# Altium schematic sheet EVK-IRIS-W1-RMII.SchDoc
size A3; DocumentNumber: 12; SheetNumber: 12; SheetTotal: 14
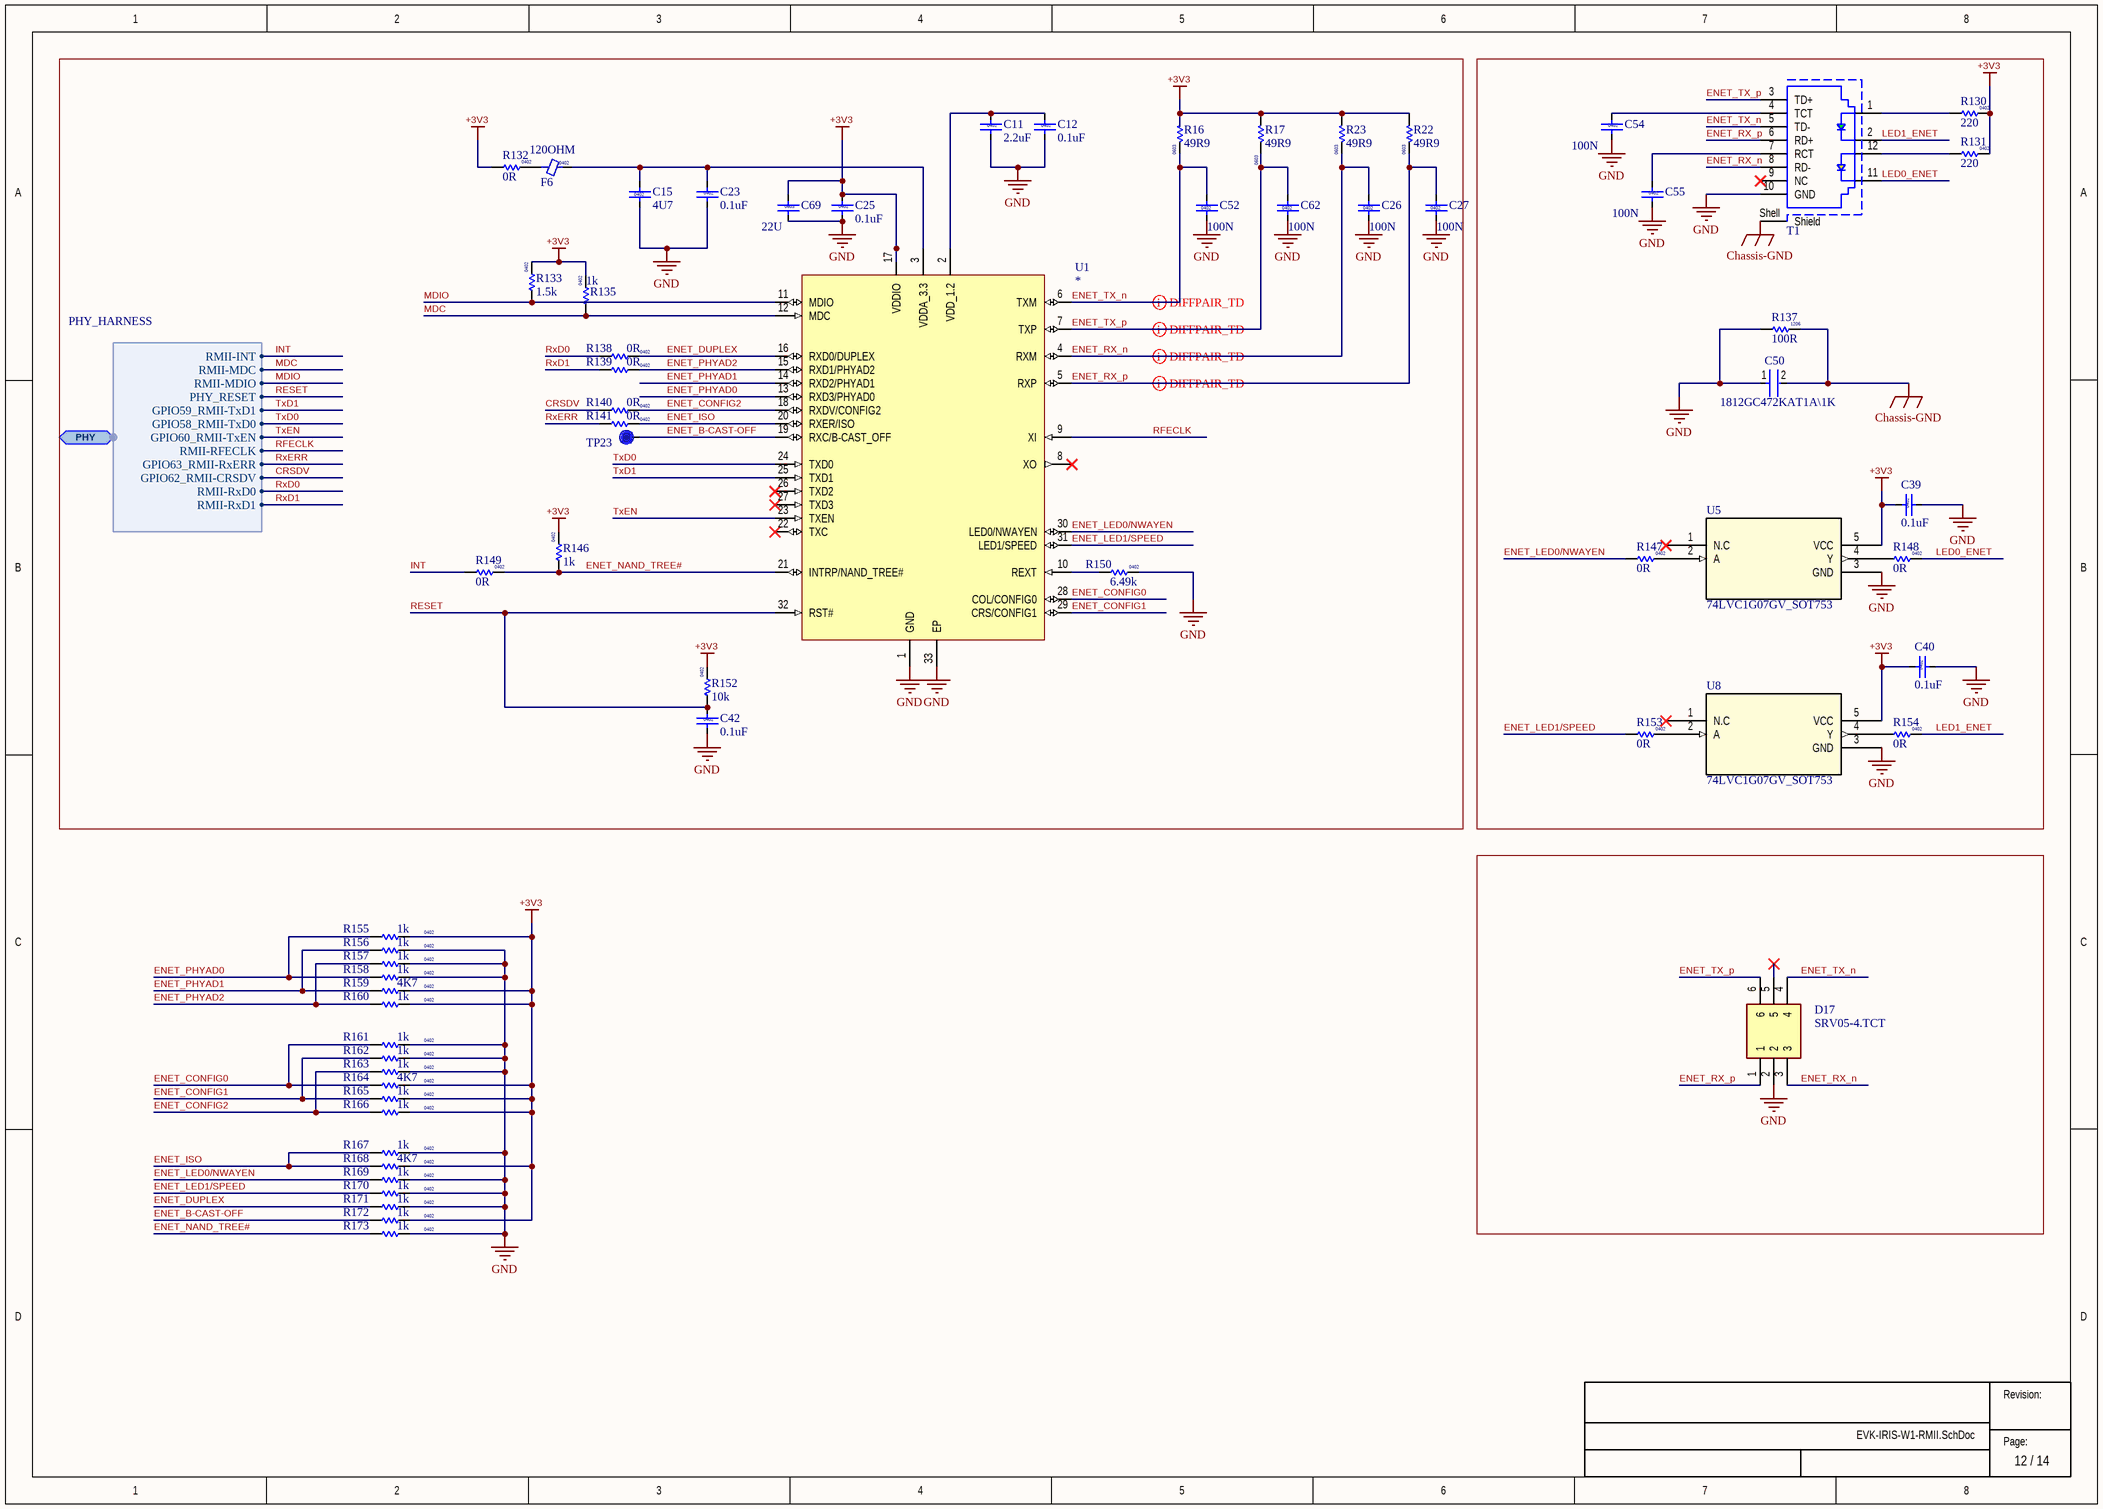
[diagram p0: EVK-IRIS-W1-RMII.SchDoc]

## Parts
C11  value 2.2uF  Size: 0402  [Cap 0402 HD]
C12  value 0.1uF  Size: 0402  [Cap 0402 HD]
C15  value 4U7  Size: 0402  [Cap_0402_1200Lx700Wx700H_600x600Pad_350G_FLX]
C23  value 0.1uF  Size: 0402  [Cap 0402 HD]
C25  value 0.1uF  Size: 0402  [Cap 0402 HD]
C26  value 100N  Size: 0402  [Cap 0402 HD]
C27  value 100N  Size: 0402  [Cap 0402 HD]
C39  value 0.1uF  Size: 0402  [Cap 0402 HD]
C40  value 0.1uF  Size: 0402  [Cap 0402 HD]
C42  value 0.1uF  Size: 0402  [Cap 0402 HD]
C50  1812GC472KAT1A\1K  [FP-1812-L_4_6_0_5-W_3_2_0-MFG]
C52  value 100N  Size: 0402  [CAP 0402]
C54  value 100N  Size: 0402  [Cap 0402]
C55  value 100N  Size: 0402  [Cap 0402]
C62  value 100N  Size: 0402  [CAP 0402]
C69  value 22U  Size: 0603  [cap 0603]
D17  SRV05-4.TCT  [SOT95P280X145-6N]
F6  value 120OHM  Size: 0402  [IND 0402]
R16  value 49R9  Size: 0603  [RES 0603 HD]
R17  value 49R9  Size: 0603  [RES 0603 HD]
R22  value 49R9  Size: 0603  [RES 0603 HD]
R23  value 49R9  Size: 0603  [RES 0603 HD]
R130  value 220  Size: 0402  [RES 0402 HD]
R131  value 220  Size: 0402  [RES 0402 HD]
R132  value 0R  Size: 0402  [RES 0402 HD]
R133  value 1.5k  Size: 0402  [RES 0402 HD]
R135  value 1k  Size: 0402  [RES 0402 HD]
R137  value 100R  Size: 1206  [RES 1206]
R138  value 0R  Size: 0402  [RES 0402 HD]
R139  value 0R  Size: 0402  [RES 0402 HD]
R140  value 0R  Size: 0402  [RES 0402 HD]
R141  value 0R  Size: 0402  [RES 0402 HD]
R146  value 1k  Size: 0402  [RES 0402 HD]
R147  value 0R  Size: 0402  [RES 0402 HD]
R148  value 0R  Size: 0402  [RES 0402 HD]
R149  value 0R  Size: 0402  [RES 0402 HD]
R150  value 6.49k  Size: 0402  [RES 0402 HD]
R152  value 10k  Size: 0402  [RES 0402 HD]
R153  value 0R  Size: 0402  [RES 0402 HD]
R154  value 0R  Size: 0402  [RES 0402 HD]
R155  value 1k  Size: 0402  [RES 0402 HD]
R156  value 1k  Size: 0402  [RES 0402 HD]
R157  value 1k  Size: 0402  [RES 0402 HD]
R158  value 1k  Size: 0402  [RES 0402 HD]
R159  value 4K7  Size: 0402  [RES 0402 HD]
R160  value 1k  Size: 0402  [RES 0402 HD]
R161  value 1k  Size: 0402  [RES 0402 HD]
R162  value 1k  Size: 0402  [RES 0402 HD]
R163  value 1k  Size: 0402  [RES 0402 HD]
R164  value 4K7  Size: 0402  [RES 0402 HD]
R165  value 1k  Size: 0402  [RES 0402 HD]
R166  value 1k  Size: 0402  [RES 0402 HD]
R167  value 1k  Size: 0402  [RES 0402 HD]
R168  value 4K7  Size: 0402  [RES 0402 HD]
R169  value 1k  Size: 0402  [RES 0402 HD]
R170  value 1k  Size: 0402  [RES 0402 HD]
R171  value 1k  Size: 0402  [RES 0402 HD]
R172  value 1k  Size: 0402  [RES 0402 HD]
R173  value 1k  Size: 0402  [RES 0402 HD]
T1  74980111211  [74980111211]  (value not drawn)
TP23  TP  [TP10R]  (value not drawn)
U1  (no value)  [QFN0.5P8x8-32Pin_W-Pad]
U5  74LVC1G07GV_SOT753  [sot-753]
U8  74LVC1G07GV_SOT753  [sot-753]

## Ports
PHY (bidir, harness PHY_HARNESS)

## Harnesses
PHY_HARNESS: RMII-MDIO, RMII-MDC, PHY_RESET, RMII-INT, GPIO59_RMII-TxD1, GPIO58_RMII-TxD0, GPIO60_RMII-TxEN, RMII-RFECLK, GPIO63_RMII-RxERR, GPIO62_RMII-CRSDV, RMII-RxD0, RMII-RxD1

## Nets
+3V3: C25.1 C39.1 C40.1 C69.1 R16.1 R17.1 R22.1 R23.1 R130.2 R131.2 R132.1 R133.2 R135.2 R146.2 R152.2 R155.2 R159.2 R160.2 R164.2 R165.2 R166.2 R168.2 R172.2 U1.17(VDDIO) U5.5(VCC) U8.5(VCC)
Chassis-GND: C50.2 R137.2 T1.Shell(Shield)
GND: C11.2 C12.2 C15.2 C23.2 C25.2 C26.1 C27.1 C39.2 C40.2 C42.2 C50.1 C52.2 C54.2 C55.2 C62.1 C69.2 D17.2 R137.1 R150.2 R156.2 R157.2 R158.2 R161.2 R162.2 R163.2 R167.2 R169.2 R170.2 R171.2 R173.2 T1.10(GND) U1.1(GND) U1.33(EP) U5.3(GND) U8.3(GND)
CRSDV: R140.1 ; port PHY.GPIO62_RMII-CRSDV
ENET_B-CAST-OFF: R172.1 TP23.1 U1.19(RXC/B-CAST_OFF)
ENET_CONFIG0: R161.1 R164.1 U1.28(COL/CONFIG0)
ENET_CONFIG1: R162.1 R165.1 U1.29(CRS/CONFIG1)
ENET_CONFIG2: R140.2 R163.1 R166.1 U1.18(RXDV/CONFIG2)
ENET_DUPLEX: R138.2 R171.1 U1.16(RXD0/DUPLEX)
ENET_ISO: R141.2 R167.1 R168.1 U1.20(RXER/ISO)
ENET_LED0/NWAYEN: R147.1 R169.1 U1.30(LED0/NWAYEN)
ENET_LED1/SPEED: R153.1 R170.1 U1.31(LED1/SPEED)
ENET_NAND_TREE#: R146.1 R149.2 R173.1 U1.21(INTRP/NAND_TREE#)
ENET_PHYAD0: R155.1 R158.1 U1.13(RXD3/PHYAD0)
ENET_PHYAD1: R156.1 R159.1 U1.14(RXD2/PHYAD1)
ENET_PHYAD2: R139.2 R157.1 R160.1 U1.15(RXD1/PHYAD2)
ENET_RX_n: C26.2 D17.3 R23.2 T1.8(RD-) U1.4(RXM)
ENET_RX_p: C27.2 D17.1 R22.2 T1.6(RD+) U1.5(RXP)
ENET_TX_n: C52.1 D17.4 R16.2 T1.5(TD-) U1.6(TXM)
ENET_TX_p: C62.2 D17.6 R17.2 T1.3(TD+) U1.7(TXP)
INT: R149.1 ; port PHY.RMII-INT
LED0_ENET: R148.2 T1.11
LED1_ENET: R154.2 T1.2
MDC: R135.1 U1.12(MDC) ; port PHY.RMII-MDC
MDIO: R133.1 U1.11(MDIO) ; port PHY.RMII-MDIO
RESET: C42.1 R152.1 U1.32(RST#) ; port PHY.PHY_RESET
RFECLK: U1.9(XI) ; port PHY.RMII-RFECLK
RxD0: R138.1 ; port PHY.RMII-RxD0
RxD1: R139.1 ; port PHY.RMII-RxD1
RxERR: R141.1 ; port PHY.GPIO63_RMII-RxERR
TxD0: U1.24(TXD0) ; port PHY.GPIO58_RMII-TxD0
TxD1: U1.25(TXD1) ; port PHY.GPIO59_RMII-TxD1
TxEN: U1.23(TXEN) ; port PHY.GPIO60_RMII-TxEN
NetC11_1: C11.1 C12.1 U1.2(VDD_1.2)
NetC15_1: C15.1 C23.1 F6.2 U1.3(VDDA_3.3)
NetC54_1: C54.1 T1.4(TCT)
NetC55_1: C55.1 T1.7(RCT)
NetF6_1: F6.1 R132.2
NetR130_1: R130.1 T1.1
NetR131_1: R131.1 T1.12
NetR147_2: R147.2 U5.2(A)
NetR148_1: R148.1 U5.4(Y)
NetR150_1: R150.1 U1.10(REXT)
NetR153_2: R153.2 U8.2(A)
NetR154_1: R154.1 U8.4(Y)

Not connected (* = marked no-connect by the designer): D17 5*; T1 9(NC)*; U1 8(XO)* 22(TXC)* 26(TXD2)* 27(TXD3)*; U5 1(N.C)*; U8 1(N.C)*

## Layout directives
differential pair; differential pair class PHY-DIff; net class PHY-DIff: ENET_RX_n, ENET_RX_p, ENET_TX_n, ENET_TX_p

## Notes on the sheet
- Revision:
- Page:

## Library data of the parts
C11 = 120-00042: Cap, Ceramic 2.2uF 6.3V 10% X5R 0402; Manufacturer 1: NIC Components Inc; Manufacturer Part Number 1: NMC0402X5R225K6.3TRPF; Part Name: CAP CER 2.2UF 6.3V 10% X5R 0402; Item Phase: In Production; Tolerance: +/- 10%; Use in new designs: Yes; UBX Code: None; Part Number: 120-00042; Supplier 1: Arrow; Supplier Part Number 1: NMC0402X5R225K6.3TRPF; Manufacturer 2: Cal-Chip Electronics; Manufacturer Part Number 2: GMC04X5R225K6R3NT; Supplier 2: None; Supplier Part Number 2: None; Height: 0.55mm; Max Operating Temp: 85; Min Operating Temp: -55; Pins: 2; Revision: 0D; Temperature Coefficient: X5R; Voltage: 6.3V
C12 C23 C25 C39 C40 C42 = 120-00016: Cap, Ceramic 0.1uF 10V 10% X5R 0402; Manufacturer 1: Murata Electronics North America; Manufacturer Part Number 1: GRM155R61A104KA01J; Part Name: CAP CER 0.1UF 10V 10% X5R 0402; Item Phase: In Production; Tolerance: +/- 10%; Use in new designs: Yes; UBX Code: None; Part Number: 120-00016; Supplier 1: Digi-Key; Supplier Part Number 1: 490-6297-1-ND; Manufacturer 2: Yageo; Manufacturer Part Number 2: CC0402KRX5R6BB104; Supplier 2: Digi-Key; Supplier Part Number 2: 311-1336-1-ND; Height: 0.55mm; Max Operating Temp: 85; Min Operating Temp: -55; Pins: 2; Revision: 0A; Temperature Coefficient: X5R; Voltage: 10V
C15 = UBXH01-0000243: CAP CER X5R 0402 4U7 20% 10V; Manufacturer: Murata Manufacturing Company, Ltd.; Manufacturer P/N: GRM155R61A475MEAA; Editor: martin.pilik; Released by: fabrice.bret-dibat; Env: GREEN; Permitted Use: Volume Products; Perferred: PREF; Mfg P/N Status: Active; Mfg P/N Split: 100; Mfg P/N Released: Yes; Part Number: UBXH01-0000243; Max Operating Temp: 85°C; Min Operating Temp: -40°C; Tolerance: 20%; Max Voltage: 10V; Part Type: Capacitor; Release Data: 2021-05-10T12:57:47; UBX Wiki: https://wiki.u-blox.com/bin/view/Operations/PartDetails?index=24303; RefDes: C; Mfg P/N Datasheet: https://wiki.u-blox.com/bin/view/Generic/Docs/DocumentSummary?index=24302
C26 C27 C52 C54 C55 C62 = UBXH01-0000233: CAP CER X7R 0402 100N 10% 16V; Manufacturer: Murata Manufacturing Company, Ltd.; Manufacturer P/N: GRM155R71C104KA88D; Editor: philippe.largier; Released by: charlotte.biber; Env: ROHS; Permitted Use: Volume Products; Perferred: PREF; Mfg P/N Status: NRND; Mfg P/N Split: 100; Mfg P/N Released: Yes; Part Number: UBXH01-0000233; Tolerance: 10%; Max Voltage: 16V; Min Operating Temp: -55°C; Max Operating Temp: 125°C; Part Type: Capacitor; Release Data: 2016-10-06T14:40:00; UBX Wiki: https://wiki.u-blox.com/bin/view/Operations/PartDetails?index=24094; RefDes: C
C50 = CMP-04427-019248-1: CAP CER 4700PF 2KV X7R 1812; Manufacturer: KYOCERA AVX; Tolerance: 10%; Temperature Coefficient: 30ppm/°C; Capacitance: 4.7nF; Dielectric Material: Ceramic; Width: 0.126inch; Radiation Hardening: No; Mount: Surface Mount; Case/Package: 1812; REACH SVHC: No SVHC; Voltage Rating: 2kV; Voltage Rating (DC): 2kV; Thickness: 0.1inch; Max Operating Temperature: 125°C; Construction: Flat; Height: 2.54mm; Voltage: 2kV; Case Code (Imperial): 1812; Length: 4.5mm; Dielectric: X7R; RoHS Compliant: Yes; Package Quantity: 1000; Min Operating Temperature: -55°C; Case Code (Metric): 4532; Lead Free: Lead Free; Depth: 3.2mm; Packaging: Tape and Reel; Termination: SMD/SMT; Series: 1812; Manufacturer P/N: 1812GC472KAT1A\1K
C69 = UBXH01-0000041: CAP CER X5R 0603 22U 20% 4V; Manufacturer: Taiyo Yuden Company, Ltd.; Manufacturer P/N: AMK107BBJ226MA-T; Editor: pierpaolo.arban; Env: ROHS; Permitted Use: Volume Products; Perferred: PREF; Mfg P/N Status: NRND; Mfg P/N Split: 100; Mfg P/N Released: No; Part Number: UBXH01-0000041; Tolerance: 20%; Max Voltage: 4V; Part Type: Capacitor; UBX Wiki: https://wiki.u-blox.com/bin/view/Operations/PartDetails?index=16911; RefDes: C; Mfg P/N Datasheet: https://wiki.u-blox.com/bin/view/Generic/Docs/DocumentSummary?index=16906
D17 = SRV05-4.TCT: TVS Diode (Uni-directional); Manufacturer_Name: SEMTECH; Datasheet Link: https://datasheet.datasheetarchive.com/originals/distributors/Datasheets-DGA26/1842016.pdf; Height: 1.45mm; Manufacturer_Part_Number: SRV05-4.TCT; Mouser Part Number: 947-SRV05-4.TCT; Mouser Price/Stock: https://www.mouser.co.uk/ProductDetail/Semtech/SRV05-4.TCT?qs=rBWM4%252BvDhIe0tfPjqKjR5Q%3D%3D; Arrow Part Number: SRV05-4.TCT; Arrow Price/Stock: https://www.arrow.com/en/products/srv05-4.tct/semtech?region=nac
F6 = UBXH08-0000000: FERRITE BEAD 0402 120 OHM AT 100MHZ 120OHM 500mA; Manufacturer: TDK Corporation; Manufacturer P/N: MMZ1005S121C; Editor: roland.rust; Permitted Use: Support Products; Mfg P/N Status: Active; Mfg P/N Split: 100; Mfg P/N Released: No; Part Number: UBXH08-0000000; Max Current: 500mA; Min Operating Temp: -40°C; Max Operating Temp: 125°C; Part Type: Ferrite; UBX Wiki: https://wiki.u-blox.com/bin/view/Operations/PartDetails?index=7958; Env: N/A; Perferred: N/A; RefDes: FB; Mfg P/N Datasheet: https://wiki.u-blox.com/bin/view/Generic/Docs/DocumentSummary?index=7940
R16 R17 R22 R23 = UBXH18-0000118: RES THICK FILM CHIP 0603 49R9 1% 100mW; Manufacturer: YAGEO; Manufacturer P/N: RC0603FR-0749R9L; Editor: peter.mueller; Env: ROHS; Permitted Use: Internal Use; Perferred: PREF; Mfg P/N Status: Active; Mfg P/N Split: 100; Mfg P/N Released: No; Part Number: UBXH18-0000118; Tolerance: 1%; Max Power: 100mW; Part Type: Resistor; UBX Wiki: https://wiki.u-blox.com/bin/view/Operations/PartDetails?index=19355; RefDes: R; Min Operating Temp: -55°C; Max Operating Temp: 155°C
R130 R131 = 180-00056: Resistor, 220ohm, 1%, 1/16W, 0402; Manufacturer 1: Rohm Semiconductor; Manufacturer Part Number 1: MCR01MRTF2200; Part Name: RES SMD 220 OHM 1% 1/16W 0402; Item Phase: In Production; Tolerance: +/- 1%; Use in new designs: Yes; Voltage: None; Part Number: 180-00056; Supplier 1: Digi-Key; Supplier Part Number 1: RHM220CDCT-ND; Manufacturer 2: Samsung Electro-Mechanics America, Inc; Manufacturer Part Number 2: RC1005F221CS; Supplier 2: Digi-Key; Supplier Part Number 2: 1276-3963-1-ND; Height: 0.4mm; Max Operating Temp: 155; Min Operating Temp: -55; Pins: 2; Power: 1/16W; Revision: 0A; UBX Code: None
R132 R138-R141 R147-R149 R153 R154 = UBXH18-0003002: RES THICK FILM CHIP 0402 0R 0 100mW; Manufacturer: KOA; Manufacturer P/N: RK73Z1ETTD; Tolerance: 0; Editor: charlotte.biber; Released by: peter.mueller; Env: ROHS; Permitted Use: Volume Products; Perferred: PREF; Mfg P/N Status: NRND; Mfg P/N Split: 100; Mfg P/N Released: Yes; Part Number: UBXH18-0003002; Manufacturer 2: YAGEO; Max Power: 100mW; Part Type: Resistor; Release Data: 2012-06-05T09:49:55; UBX Wiki: https://wiki.u-blox.com/bin/view/Operations/PartDetails?index=6611; RefDes: R; Manufacturer P/N 2: 2322_705_91001_L; Mfg P/N Status 2: NRND; Mfg P/N Split 2: 0; Mfg P/N Released 2: Yes
R133 = 180-00110: Resistor, 1.5Kohm, 1%, 1/16W, 0402; Manufacturer 1: Samsung Electro-Mechanics America, Inc; Manufacturer Part Number 1: RC1005F152CS; Part Name: RES SMD 1.5K OHM 1% 1/16W 0402; Item Phase: In Production; Tolerance: +/- 1%; Use in new designs: Yes; Voltage: None; Part Number: 180-00110; Supplier 1: Digi-Key; Supplier Part Number 1: 1276-4030-1-ND; Manufacturer 2: Panasonic Electronic Components; Manufacturer Part Number 2: ERJ-2RKF1501X; Supplier 2: Digi-Key; Supplier Part Number 2: P1.50KLCT-ND; Height: 0.4mm; Max Operating Temp: 155; Min Operating Temp: -55; Pins: 2; Power: 1/16W; Revision: 0A; UBX Code: None
R135 R146 R155-R158 R160-R163 R165-R167 R169-R173 = 180-00021: Resistor 1k ohm 1% 1/16W, 0402; Manufacturer 1: Hong Kong Resistors Manufactory; Manufacturer Part Number 1: RCT021KFLF; Part Name: RES SMD 1K OHM 1% 1/16W 0402; Item Phase: In Production; Tolerance: +/- 1%; Use in new designs: Yes; Voltage: None; Part Number: 180-00021; Supplier 1: None; Supplier Part Number 1: None; Manufacturer 2: Yageo; Manufacturer Part Number 2: RC0402FR-071KL; Supplier 2: Digi-Key; Supplier Part Number 2: 311-1.00KLRCT-ND; Height: 0.4mm; Max Operating Temp: 155; Min Operating Temp: -55; Pins: 2; Power: 1/16W; Revision: 0E; UBX Code: None
R137 = UBXH18-0000460: RES THICK FILM CHIP 1206 100R 0.1% 400mW; Manufacturer: Vishay; Manufacturer P/N: TNPW1206100RBEEA; Editor: jernej.bufon; Released by: mikhail.sialitski; Env: ROHS; Permitted Use: Support Products; Perferred: PREF; Mfg P/N Status: Active; Mfg P/N Split: 100; Mfg P/N Released: Yes; Part Number: UBXH18-0000460; Max Operating Temp: 155°C; Min Operating Temp: -55°C; Tolerance: 0.1%; Max Power: 400mW; Part Type: Resistor; Release Data: 2020-12-07T16:17:04; UBX Wiki: https://wiki.u-blox.com/bin/view/Operations/PartDetails?index=29900; RefDes: R; Mfg P/N Datasheet: https://wiki.u-blox.com/bin/view/Generic/Docs/DocumentSummary?index=29902
R150 = 180-00205: RES 6.49K OHM 1% 1/16W 0402; Manufacturer 1: Stackpole Electronics Inc; Manufacturer Part Number 1: RMCF0402FT6K49; Item Phase: In Production; Tolerance: +/- 1%; Use in new designs: Yes; Voltage: None; Part Number: 180-00205; Supplier 1: Digi-Key; Supplier Part Number 1: RMCF0402FT6K49CT-ND; Manufacturer 2: None; Manufacturer Part Number 2: None; Supplier 2: None; Supplier Part Number 2: None; Height: 0.4mm; Max Operating Temp: 155; Min Operating Temp: -55; Part Name: RES 6.49K OHM 1% 1/16W 0402; Pins: 2; Power: 1/16W; Revision: 0A; UBX Code: None
R152 = 180-00024: Resistor 10k ohm 1% 1/16W, 0402; Manufacturer 1: Samsung Electro-Mechanics America, Inc; Manufacturer Part Number 1: RC1005F103CS; Part Name: RES SMD 10K OHM 1% 1/16W 0402; Item Phase: In Production; Tolerance: +/- 1%; Use in new designs: Yes; UBX Code: None; Part Number: 180-00024; Supplier 1: Digi-Key; Supplier Part Number 1: 1276-3431-1-ND; Manufacturer 2: Hong Kong Resistors Manufactory; Manufacturer Part Number 2: RCT0210KFLF; Supplier 2: None; Supplier Part Number 2: None; Height: 0.4mm; Max Operating Temp: 155; Min Operating Temp: -55; Pins: 2; Power: 1/16W; Revision: 0E; Voltage: N/A
R159 R164 R168 = UBXH18-0000213: RES THICK FILM CHIP 0402 4K7 1% 63mW; Manufacturer: KOA; Manufacturer P/N: RK73H1ETTP4701F; Editor: michael.hein; Released by: vasyl.dykyy; Env: ROHS; Permitted Use: Volume Products; Perferred: PREF; Mfg P/N Status: Active; Mfg P/N Split: 100; Mfg P/N Released: Yes; Part Number: UBXH18-0000213; Tolerance: 1%; Max Power: 63mW; Part Type: Resistor; Release Data: 2015-10-02T11:47:33; Automotive: Yes; UBX Wiki: https://wiki.u-blox.com/bin/view/Operations/PartDetails?index=23300; RefDes: R; Mfg P/N Datasheet: https://wiki.u-blox.com/bin/view/Generic/Docs/DocumentSummary?index=8222
T1 = 74980111211: WE-RJ45 LAN Transformer, 1 Port, 10/100 Base-T, Tab Up; Manufacturer: Wurth Elektronik; LED: yellow-green; Number of Ports: 1; PoE: non-PoE; Shield Tabs: Yes; USB: No USB; Manufacturer Part Number: 74980111211; Category: Filtered Connectors; Match Code: WE-RJ45 LAN; ComponentLink1Description: Website Link; ComponentLink1URL: https://www.we-online.com/redexpert/article/74980111211?ad; ComponentLink2Description: Datasheet Link; ComponentLink2URL: https://www.we-online.com/redexpert/spec/74980111211?ad; Mount: Surface Mount; Operating Temperature Max: 85°C; Operating Temperature Min: -40°C; Packaging: Tape and Reel; Length: 25.4mm; Width: 16.1mm; Height: 13.61mm; Data Rate: 10/100 Base-T; Tab: Up
TP23 = TP10R: Testpoint, Round 1.0mm Dia; Added By: Jeremy D; Part Number: TP10R; Size: 1.0mm; Height: 0; DNP: DNP; Added Date: 2015-02-01; Checked By: Paul B; Checked Date: 2015-02-05
U1 = 220-00037: IC TXRX ETHERNET 32QFN; Manufacturer 1: Microchip Technology; Manufacturer Part Number 1: KSZ8081RNBCA-TR; Part Name: KSZ8081RNBCA; Body Size: 5mmx 5mm; Interface: RMII; Item Phase: In Production; MFG Package: 32-QFN (5x5); SMT Pitch: 0.5mm; Thermal Pad: Yes; Voltage: None; Manufacturer P/N: *; Part Number: 220-00037; Supplier 1: Digi-Key; Supplier Part Number 1: 576-4175-1-ND; Height: 1mm; Max Operating Temp: 70; Min Operating Temp: 0; Pins: 32; Revision: 0A; Use in new designs: Yes; UBX Code: None
U5 U8 = 74LVC1G07GV_SOT753: No Description Available; Mfr_Name: Nexperia; Copyright: Copyright (C) 2023 Ultra Librarian. All rights reserved.; Manufacturer_Part_Number: 74LVC1G07GV_SOT753; RefDes: RefDes; Type: DEV